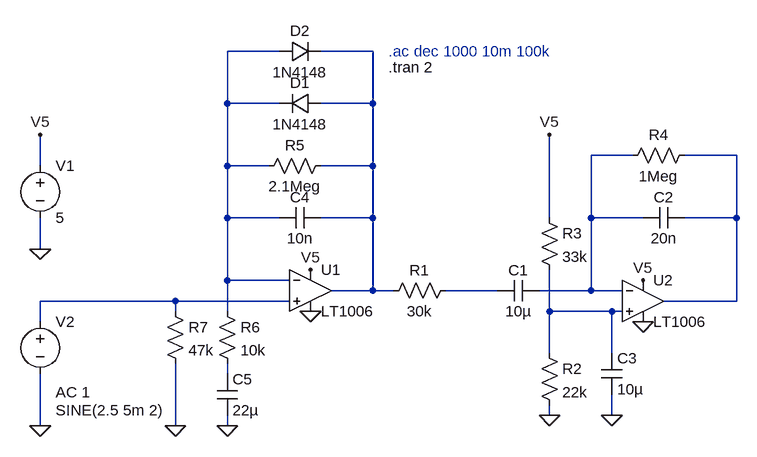
[diagram p0: schematic kjhgkhgkj.asc]
kjhgkhgkj.asc, the LTspice schematic file:
Version 4
SHEET 1 1016 680
WIRE 304 -272 224 -272
WIRE 448 -272 368 -272
WIRE 224 -192 224 -272
WIRE 304 -192 224 -192
WIRE 448 -192 448 -272
WIRE 448 -192 368 -192
WIRE 848 -112 784 -112
WIRE 1008 -112 928 -112
WIRE -64 -96 -64 -144
WIRE 224 -96 224 -192
WIRE 288 -96 224 -96
WIRE 448 -96 448 -192
WIRE 448 -96 368 -96
WIRE 224 -16 224 -96
WIRE 304 -16 224 -16
WIRE 448 -16 448 -96
WIRE 448 -16 368 -16
WIRE 720 -16 720 -144
WIRE 784 -16 784 -112
WIRE 864 -16 784 -16
WIRE 1008 -16 1008 -112
WIRE 1008 -16 928 -16
WIRE -64 32 -64 -16
WIRE 224 80 224 -16
WIRE 320 80 224 80
WIRE 448 96 448 -16
WIRE 448 96 384 96
WIRE 480 96 448 96
WIRE 640 96 560 96
WIRE 784 96 784 -16
WIRE 784 96 704 96
WIRE 832 96 784 96
WIRE 144 112 -64 112
WIRE 320 112 144 112
WIRE 1008 112 1008 -16
WIRE 1008 112 896 112
WIRE 144 128 144 112
WIRE 224 128 224 80
WIRE 720 128 720 64
WIRE 816 128 720 128
WIRE 832 128 816 128
WIRE -64 144 -64 112
WIRE 720 192 720 128
WIRE 816 192 816 128
WIRE 224 224 224 208
WIRE 720 288 720 272
WIRE 816 288 816 256
WIRE -64 304 -64 224
WIRE 144 304 144 208
WIRE 224 304 224 288
FLAG 720 288 0
FLAG 816 288 0
FLAG 224 304 0
FLAG 144 304 0
FLAG -64 -144 V5
FLAG 720 -144 V5
FLAG -64 32 0
FLAG 352 64 V5
FLAG 864 80 V5
FLAG 352 128 0
FLAG 864 144 0
FLAG -64 304 0
SYMBOL Opamps\\LT1006 352 32 R0
SYMATTR InstName U1
SYMBOL Opamps\\LT1006 864 48 R0
SYMATTR InstName U2
SYMBOL res 576 80 R90
WINDOW 0 0 56 VBottom 2
WINDOW 3 32 56 VTop 2
SYMATTR InstName R1
SYMATTR Value 30k
SYMBOL cap 704 80 R90
WINDOW 0 0 32 VBottom 2
WINDOW 3 32 32 VTop 2
SYMATTR InstName C1
SYMATTR Value 10µ
SYMBOL res 704 176 R0
SYMATTR InstName R2
SYMATTR Value 22k
SYMBOL res 704 -32 R0
SYMATTR InstName R3
SYMATTR Value 33k
SYMBOL res 944 -128 R90
WINDOW 0 0 56 VBottom 2
WINDOW 3 32 56 VTop 2
SYMATTR InstName R4
SYMATTR Value 1Meg
SYMBOL cap 928 -32 R90
WINDOW 0 0 32 VBottom 2
WINDOW 3 32 32 VTop 2
SYMATTR InstName C2
SYMATTR Value 20n
SYMBOL res 384 -112 R90
WINDOW 0 0 56 VBottom 2
WINDOW 3 32 56 VTop 2
SYMATTR InstName R5
SYMATTR Value 2.1Meg
SYMBOL cap 368 -32 R90
WINDOW 0 0 32 VBottom 2
WINDOW 3 32 32 VTop 2
SYMATTR InstName C4
SYMATTR Value 10n
SYMBOL cap 208 224 R0
SYMATTR InstName C5
SYMATTR Value 22µ
SYMBOL res 208 112 R0
SYMATTR InstName R6
SYMATTR Value 10k
SYMBOL res 128 112 R0
SYMATTR InstName R7
SYMATTR Value 47k
SYMBOL voltage -64 -112 R0
WINDOW 123 0 0 Left 2
WINDOW 39 0 0 Left 2
SYMATTR InstName V1
SYMATTR Value 5
SYMBOL voltage -64 128 R0
WINDOW 3 24 152 Left 2
WINDOW 123 24 124 Left 2
WINDOW 39 0 0 Left 2
SYMATTR Value SINE(2.5 5m 2)
SYMATTR Value2 AC 1
SYMATTR InstName V2
SYMBOL diode 368 -208 R90
WINDOW 0 0 32 VBottom 2
WINDOW 3 32 32 VTop 2
SYMATTR InstName D1
SYMATTR Value 1N4148
SYMBOL diode 304 -256 R270
WINDOW 0 32 32 VTop 2
WINDOW 3 0 32 VBottom 2
SYMATTR InstName D2
SYMATTR Value 1N4148
SYMBOL cap 800 192 R0
SYMATTR InstName C3
SYMATTR Value 10µ
TEXT 472 -272 Left 2 ;.ac dec 1000 10m 100k
TEXT 472 -248 Left 2 !.tran 2

The netlist it stands for:
* kjhgkhgkj.asc
XU1 N006 N001 V5 0 N002 LT1006  ; pins In+ In- V+ V- OUT
XU2 N007 N003 V5 0 N004 LT1006  ; pins In+ In- V+ V- OUT
R1 N005 N002 30k
C1 N003 N005 10µ
R2 N007 0 22k
R3 V5 N007 33k
R4 N004 N003 1Meg
C2 N004 N003 20n
R5 N002 N001 2.1Meg
C4 N002 N001 10n
C5 N008 0 22µ
R6 N001 N008 10k
R7 N006 0 47k
V1 V5 0 5
V2 N006 0 SINE(2.5 5m 2) AC 1
D1 N002 N001 1N4148
D2 N001 N002 1N4148
C3 N007 0 10µ
.model D D
.lib standard.dio
* .ac dec 1000 10m 100k
.tran 2
.lib LTC.lib
.backanno
.end